# EAGLE design relay (EAGLE 7.6.0)
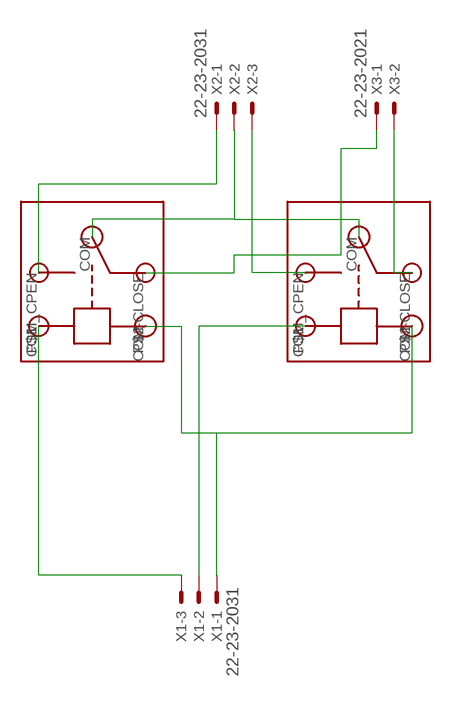
[diagram p0: schematic, sheet 1]

## Parts
U$1  RELAY  [RELAY]
U$2  RELAY  [RELAY]
X1  22-23-2031  [22-23-2031]
X2  22-23-2031  [22-23-2031]
X3  22-23-2021  [22-23-2021]

## Nets
GND: U$1.P$2(GND) U$2.P$2(GND) X1.1
N$1: U$1.P$1(IN) X1.3
N$2: U$2.P$1(IN) X1.2
N$3: U$1.COM-CLOSE X3.1
N$4: U$1.COM_CPEN(COM-OPEN) X2.1
N$5: U$2.COM_CPEN(COM-OPEN) X2.3
N$6: U$1.COM U$2.COM X2.2
N$7: U$2.COM-CLOSE X3.2

## Library data of the parts
U$1 U$2 = relay:RELAY
X1 X2 = con-molex:22-23-2031: .100" (2.54mm) Center Header - 3 Pin; MF: MOLEX; MPN: 22-23-2031; OC_FARNELL: 1462950; OC_NEWARK: 30C0862
X3 = con-molex:22-23-2021: .100" (2.54mm) Center Header - 2 Pin; MF: MOLEX; MPN: 22-23-2021; OC_FARNELL: 1462926; OC_NEWARK: 25C3832

## Net classes
0 default: width 1.016 mm, drill 1.016 mm, clearance 1.27 mm

## Board
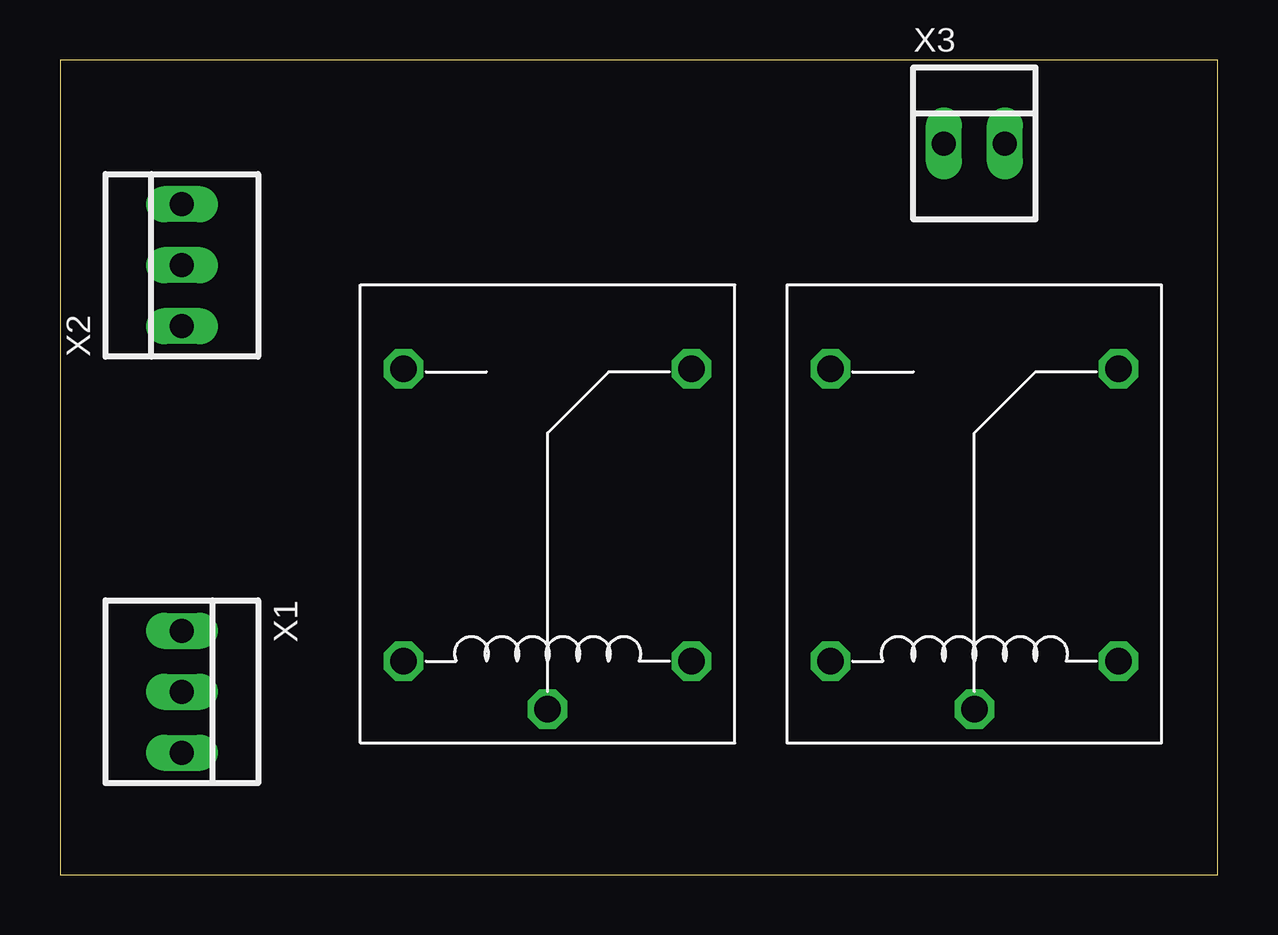
[diagram p1: board, top side]
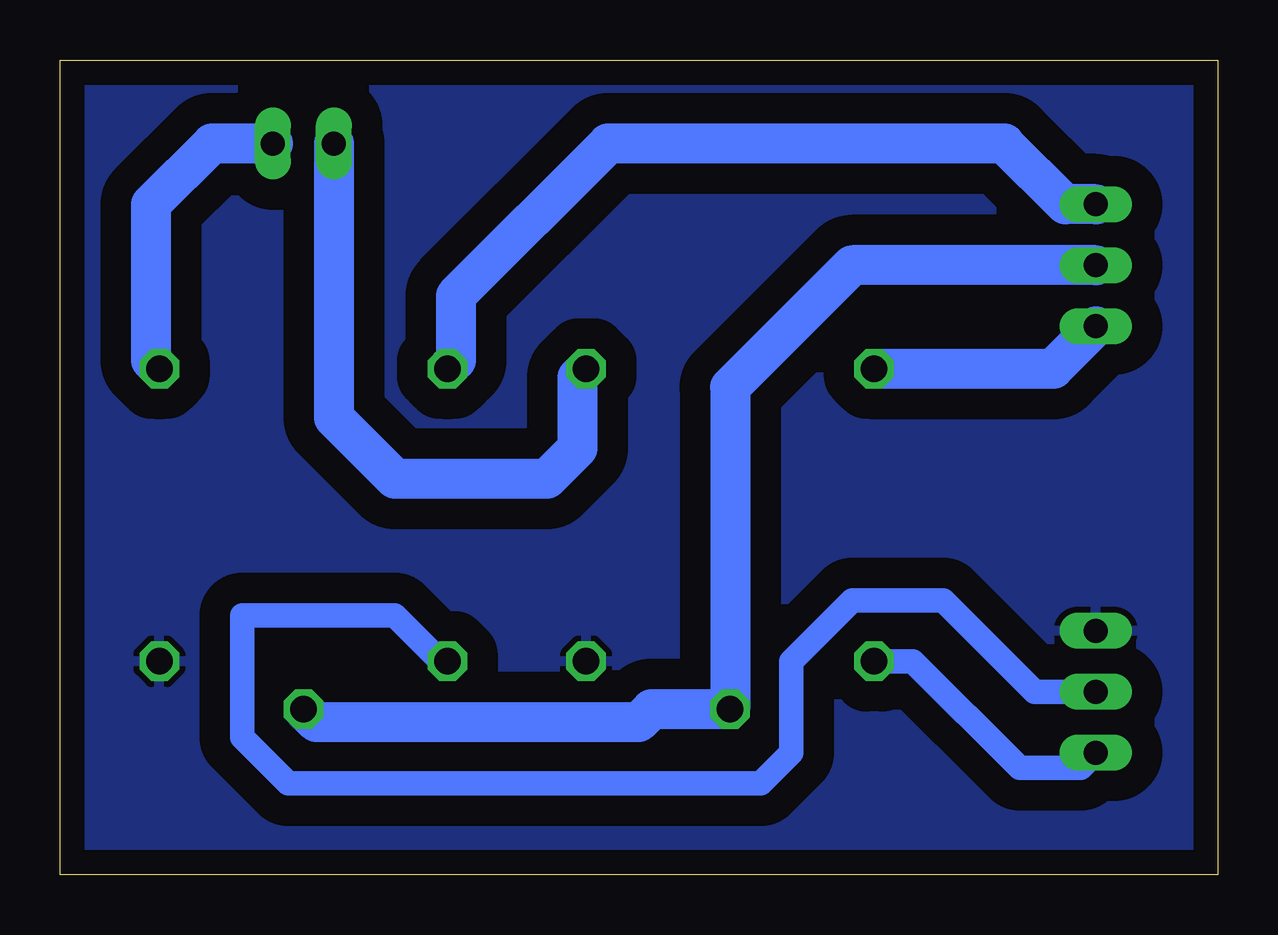
[diagram p2: board, bottom side, seen from below]

Size 48.24 x 33.96 mm. Coordinates in mm from the lower left corner, seen from the top.
Outline: 0,0 48.24,0 48.24,33.96 0,33.96 0,0
Copper layers (1*16): Top 0.035mm / dielectric 1.5mm / Bottom 0.035mm
Design rules "default": minimum track width 10mil, minimum drill 24mil, track to track 8mil, track to pad 8mil, pad to pad 8mil, via to via 8mil, smd to smd 8mil, copper to edge 40mil, drill to drill 8mil, minimum pad ring 10mil, minimum via ring 8mil, stop-mask expansion 4mil, vias tented up to drill 0mil, thermal gap 10mil

### Footprints (pad centres in the part's own frame; a part is rotated, then mirrored left to right if it is on the bottom)
RELAY = drill 1.1 octagon: COM -2,0; COM-CLOSE 12.2,-6; COM_CPEN 12.2,6; P$1 0,6; P$2 0,-6
22-23-2031 = drill 1 long: 1 -2.54,0; 2 0,0; 3 2.54,0
22-23-2021 = drill 1 long: 1 -1.27,0; 2 1.27,0

### Placement (x,y rotation side)
U$1  20.32,8.89 90 top
U$2  38.1,8.89 90 top
X1  5.08,7.62 270 top
X2  5.08,25.4 90 top
X3  38.1,30.48 0 top

### Tracks (layer width: path | path; a pad name or v marks a point on that pad's centre or on a via)
GND
  pour Bottom: 0,34.29 48.26,34.29 48.26,0 0,0
N$1
  Bottom 1.016: X1.3 5.71,4.44 8.26,4.44 12.7,8.89 U$1.P$1
N$2
  Bottom 1.016: X1.2 7.62,7.62 11.43,11.43 15.24,11.43 17.78,8.89 17.78,5.08 19.05,3.81 38.73,3.81 40.64,5.71 40.64,10.79 34.29,10.79 32.38,8.89 U$2.P$1
N$3
  Bottom 1.676: X3.1 36.83,19.05 34.29,16.51 27.94,16.51 26.67,17.78 26.67,20.74 U$1.COM-CLOSE
N$4
  Bottom 1.676: U$1.COM_CPEN 6.85,21.09 X2.1
N$5
  Bottom 1.676: X2.3 6.35,27.94 8.89,30.48 25.4,30.48 31.75,24.13 31.75,21.44 U$2.COM_CPEN
N$6
  Bottom 1.676: X2.2 15.24,25.4 20.32,20.32 U$1.COM 23.59,6.89 24.13,6.35 37.56,6.35 U$2.COM
N$7
  Bottom 1.676: X3.2 41.91,30.48 44.45,27.94 44.45,21.44 U$2.COM-CLOSE